# EAGLE design ethernet_jack_cnc_shield_2.5 (EAGLE 9.6.1)
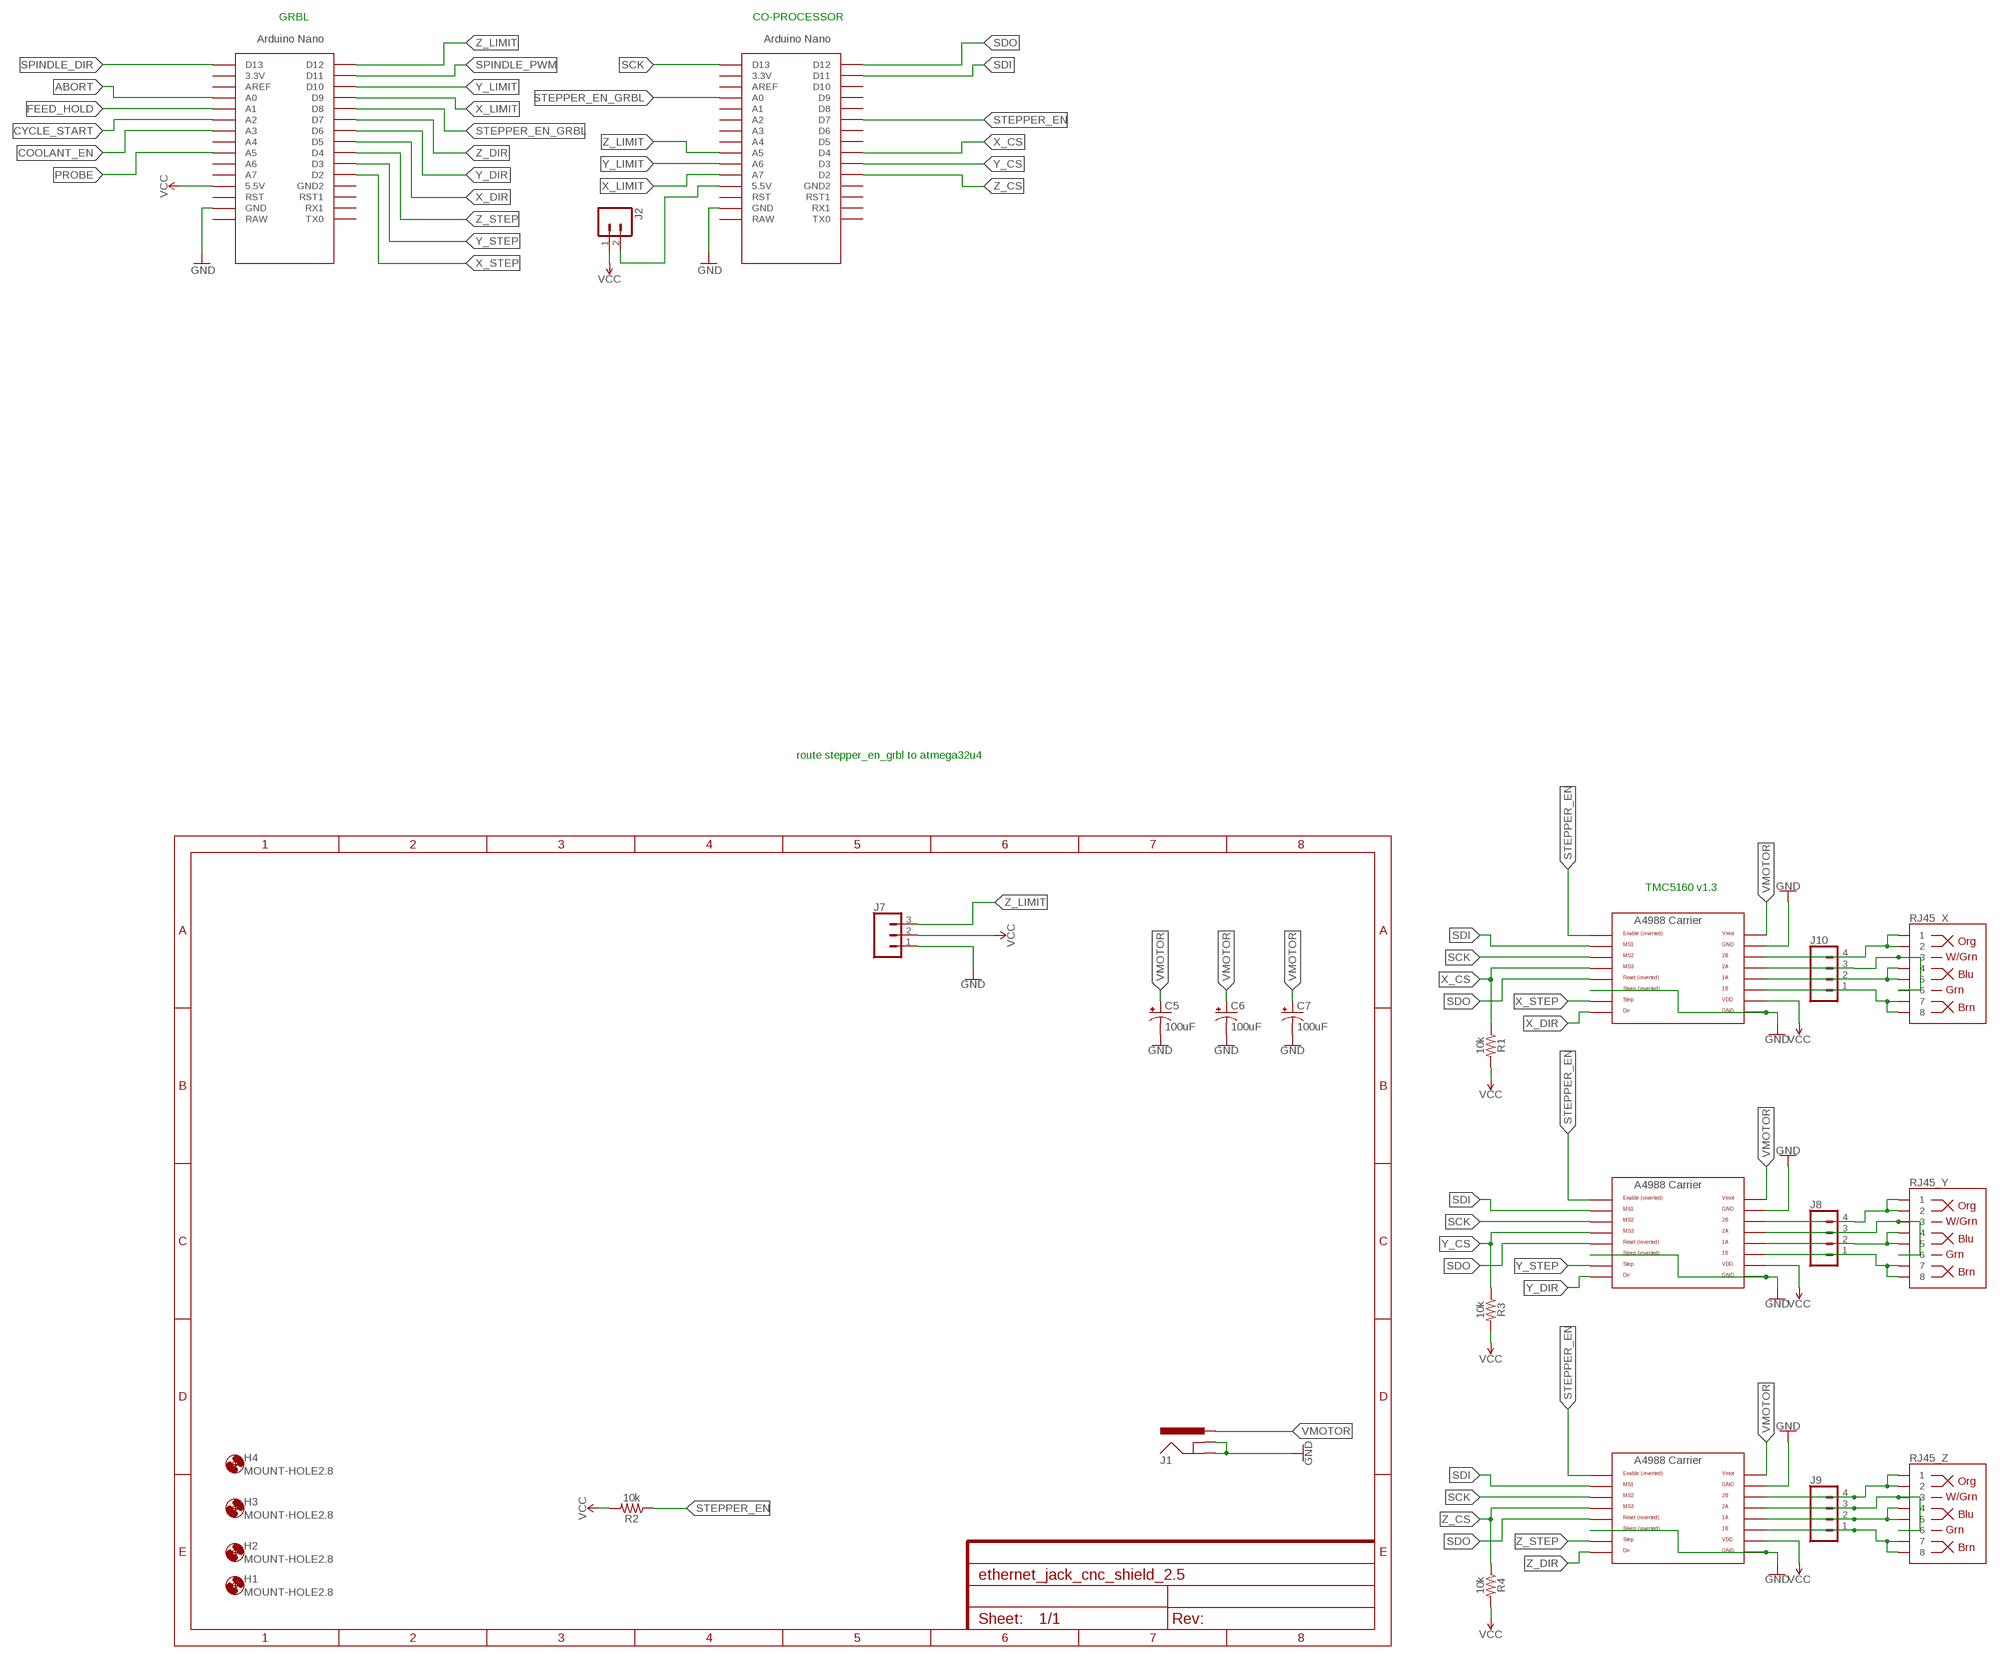
[diagram p0: schematic, sheet 1]

## Parts
C5  100uF  100UF-POLAR-25V-20%(ELEC)  [PANASONIC_D]
C6  100uF  100UF-POLAR-25V-20%(ELEC)  [PANASONIC_D]
C7  100uF  100UF-POLAR-25V-20%(ELEC)  [PANASONIC_D]
H1  MOUNT-HOLE2.8  [2,8]
H2  MOUNT-HOLE2.8  [2,8]
H3  MOUNT-HOLE2.8  [2,8]
H4  MOUNT-HOLE2.8  [2,8]
J1  POWER_JACKPTH_BREAD  [POWER_JACK_PTH_BREAD]
J2  M02PTH  [1X02]
J7  CONN_03  [1X03]
J8  CONN_04  [1X04]
J9  CONN_04  [1X04]
J10  CONN_04  [1X04]
R1  10k  RESISTOR1206  [1206]
R2  10k  RESISTOR1206  [1206]
R3  10k  RESISTOR1206  [1206]
R4  10k  RESISTOR1206  [1206]
RJ45_X  RJ45  RJ45-8  [RJ45-8]
RJ45_Y  RJ45  RJ45-8  [RJ45-8]
RJ45_Z  RJ45  RJ45-8  [RJ45-8]
U$2  A4988BREAKOUT  [A4988BREAKOUT]
U$3  A4988BREAKOUT  [A4988BREAKOUT]
U$4  A4988BREAKOUT  [A4988BREAKOUT]
U$5  NANO  [NANO]
U$7  NANO  [NANO]

## Nets
ABORT: U$5.A0
COOLANT_EN: U$5.A3
CYCLE_START: U$5.A2
FEED_HOLD: U$5.A1
GND: C5.- C6.- C7.- J1.GND J1.GNDBREAK J7.1 U$2.GND U$2.GND@0(GND) U$2.SLP(SLEEP) U$3.GND U$3.GND@0(GND) U$3.SLP(SLEEP) U$4.GND U$4.GND@0(GND) U$4.SLP(SLEEP) U$5.GND U$7.GND
N$1 [power]: J10.4 RJ45_X.1 RJ45_X.2 U$4.2B
N$2: J2.2 U$7.5V(5.5V)
N$4 [power]: J10.3 RJ45_X.3 RJ45_X.6 U$4.2A
N$6 [power]: J10.2 RJ45_X.4 RJ45_X.5 U$4.1A
N$8 [power]: J10.1 RJ45_X.7 RJ45_X.8 U$4.1B
N$20 [power]: J8.4 RJ45_Y.1 RJ45_Y.2 U$2.2B
N$21 [power]: J8.3 RJ45_Y.3 RJ45_Y.6 U$2.2A
N$22 [power]: J8.2 RJ45_Y.4 RJ45_Y.5 U$2.1A
N$23 [power]: J8.1 RJ45_Y.7 RJ45_Y.8 U$2.1B
N$28 [power]: J9.4 RJ45_Z.1 RJ45_Z.2 U$3.2B
N$29 [power]: J9.3 RJ45_Z.3 RJ45_Z.6 U$3.2A
N$30 [power]: J9.2 RJ45_Z.4 RJ45_Z.5 U$3.1A
N$31 [power]: J9.1 RJ45_Z.7 RJ45_Z.8 U$3.1B
PROBE: U$5.A5
SCK: U$2.MS2 U$3.MS2 U$4.MS2 U$7.D13
SDI: U$2.MS1 U$3.MS1 U$4.MS1 U$7.D11
SDO: U$2.RST U$3.RST U$4.RST U$7.D12
SPINDLE_DIR: U$5.D13
SPINDLE_PWM: U$5.D11
STEPPER_EN: R2.1 U$2.EN U$3.EN U$4.EN U$7.D7
STEPPER_EN_GRBL: U$5.D8 U$7.A0
VCC: J2.1 J7.2 R1.2 R2.2 R3.2 R4.2 U$2.VDD U$3.VDD U$4.VDD U$5.5V(5.5V)
VMOTOR [power]: C5.+ C6.+ C7.+ J1.PWR U$2.VMOT U$3.VMOT U$4.VMOT
X_CS: R1.1 U$4.MS3 U$7.D4
X_DIR: U$4.DIR U$5.D5
X_LIMIT: U$5.D9 U$7.A7
X_STEP: U$4.STEP U$5.D2
Y_CS: R3.1 U$2.MS3 U$7.D3
Y_DIR: U$2.DIR U$5.D6
Y_LIMIT: U$5.D10 U$7.A6
Y_STEP: U$2.STEP U$5.D3
Z_CS: R4.1 U$3.MS3 U$7.D2
Z_DIR: U$3.DIR U$5.D7
Z_LIMIT: J7.3 U$5.D12 U$7.A5
Z_STEP: U$3.STEP U$5.D4
Unconnected: U$5.3.3V U$5.A4 U$5.A6 U$5.A7 U$5.AREF U$5.GND1(GND2) U$5.ICSP1 U$5.ICSP2 U$5.ICSP3 U$5.ICSP4 U$5.ICSP5 U$5.ICSP6 U$5.RAW U$5.RST U$5.RST1 U$5.RX1 U$5.TX0 U$7.3.3V U$7.A1 U$7.A2 U$7.A3 U$7.A4 U$7.AREF U$7.D5 U$7.D6 U$7.D8 U$7.D9 U$7.D10 U$7.GND1(GND2) U$7.ICSP1 U$7.ICSP2 U$7.ICSP3 U$7.ICSP4 U$7.ICSP5 U$7.ICSP6 U$7.RAW U$7.RST U$7.RST1 U$7.RX1 U$7.TX0

## Notes on the sheet
- GRBL | CO-PROCESSOR
- route stepper_en_grbl to atmega32u4
- TMC5160 v1.3

## Library data of the parts
C5-C7 = SparkFun-Capacitors:100UF-POLAR: 100µF polarized capacitors A capacitor is a passive two-terminal electrical component used to store electrical energy temporarily in an electric field.; PROD_ID: CAP-12547
H1-H4 = holes:MOUNT-HOLE: MOUNTING HOLE with drill center marker
J1 = SparkFun-Connectors:POWER_JACK: Power Jack Connector This is the standard 5.5mm barrel jack for power. The PTH is the most common, proven, reliable, footprint. The Slot footprint only works if the mill layer is transmitted to the PCB fab house so be warned. Here are the connectors we sell at SparkFun: DC Barrel Power Jack/Connector <https://www.sparkfun.com/products/119> (PRT-00119) DC Barrel Power Jack/Connector (SMD) <https://www.sparkfun.com/products/12748> (PRT-12748) DC Barrel Jack Adapter - Breadboard Compatible <https://www.sparkfun.com/products/10811> (PRT-10811) It is used on this SparkFun product (and many, many others): SparkFun RedBoard - Programmed with Arduino <https://www.sparkfun.com/products/12757> (DEV-12757) Also, if you need a mating power supply or connector, please check these out: Wall Adapter Power Supply - 9VDC 650mA <https://www.sparkfun.com/products/298> (TOL-00298) DC Barrel Jack Adapter - Male <https://www.sparkfun.com/products/10287> (PRT-10287); PROD_ID: PRT-10811
J2 = SparkFun-Connectors:M02: Standard 2-pin 0.1" header. Use with - straight break away headers ( PRT-00116) - right angle break away headers (PRT-00553) - swiss pins (PRT-00743) - machine pins (PRT-00117) - female headers (PRT-00115) Molex polarized connector foot print use with: PRT-08233 with associated crimp pins and housings. 2.54_SCREWTERM for use with PRT-10571. 3.5mm Screw Terminal footprints for PRT-08084 5mm Screw Terminal footprints for use with PRT-08432
J7 = SparkFun-Connectors:CONN_03: Multi connection point. Often used as Generic Header-pin footprint for 0.1 inch spaced/style header connections On any of the 0.1 inch spaced packages, you can populate with these: Break Away Headers - Straight <https://www.sparkfun.com/products/116> (PRT-00116) Break Away Male Headers - Right Angle <https://www.sparkfun.com/products/553> (PRT-00553) Female Headers <https://www.sparkfun.com/products/115> (PRT-00115) Break Away Headers - Machine Pin <https://www.sparkfun.com/products/117> (PRT-00117) Break Away Female Headers - Swiss Machine Pin <https://www.sparkfun.com/products/743> (PRT-00743) Stackable Header - 3 Pin (Female, 0.1") <https://www.sparkfun.com/products/13875> (PRT-13875) For SCREWTERMINALS and SPRING TERMINALS visit here: Screw Terimnals on SparkFun.com <https://www.sparkfun.com/search/results?term=Screw+Terminals> (5mm/3.5mm/2.54mm spacing) This device is also useful as a general connection point to wire up your design to another part of your project. Our various solder wires solder well into these plated through hole pads. Hook-Up Wire - Assortment (Stranded, 22 AWG) <https://www.sparkfun.com/products/11375> (PRT-11375) Hook-Up Wire - Assortment (Solid Core, 22 AWG) <https://www.sparkfun.com/products/11367> (PRT-11367) View the entire wire category on our website here <https://www.sparkfun.com/categories/141> Special notes: Molex polarized connector foot print use with SKU : PRT-08232 with associated crimp pins and housings.
J8-J10 = SparkFun-Connectors:CONN_04: Multi connection point. Often used as Generic Header-pin footprint for 0.1 inch spaced/style header connections On any of the 0.1 inch spaced packages, you can populate with these: Break Away Headers - Straight <https://www.sparkfun.com/products/116> (PRT-00116) Break Away Male Headers - Right Angle <https://www.sparkfun.com/products/553> (PRT-00553) Female Headers <https://www.sparkfun.com/products/115> (PRT-00115) Break Away Headers - Machine Pin <https://www.sparkfun.com/products/117> (PRT-00117) Break Away Female Headers - Swiss Machine Pin <https://www.sparkfun.com/products/743> (PRT-00743) For SCREWTERMINALS and SPRING TERMINALS visit here: Screw Terimnals on SparkFun.com <https://www.sparkfun.com/search/results?term=Screw+Terminals> (5mm/3.5mm/2.54mm spacing) This device is also useful as a general connection point to wire up your design to another part of your project. Our various solder wires solder well into these plated through hole pads. Hook-Up Wire - Assortment (Stranded, 22 AWG) <https://www.sparkfun.com/products/11375> (PRT-11375) Hook-Up Wire - Assortment (Solid Core, 22 AWG) <https://www.sparkfun.com/products/11367> (PRT-11367) View the entire wire category on our website here <https://www.sparkfun.com/categories/141> Special notes: Molex polarized connector foot print use with SKU : PRT-08231 with associated crimp pins and housings. 1MM SMD Version SKU: PRT-10208; PROD_ID: CONN-09696
R1-R4 = SparkFun-Resistors:RESISTOR: Generic Resistor Package
RJ45_X RJ45_Y RJ45_Z = SparkFun-Connectors:RJ45-8: RJ45 Jack - 8 pin Simple RJ45, 8-pin connection. Commonly used for Cat5, Cat5e, and Cat6 Ethernet cables. Here is the connector we sell at SparkFun: RJ45 8-Pin Connector <https://www.sparkfun.com/products/643> (PRT-00643) Datasheet <https://cdn.sparkfun.com/datasheets/Prototyping/04908.pdf> It is used on this SparkFun product: SparkFun RJ45 Breakout <https://www.sparkfun.com/products/716> (BOB-00716) Note, you may also be interested in the "MAGJACK" version of this. It is basically a RJ45 connector, but also has some status LEDs built into the connector housing. You can check that out in this library at the device named "MAGJACK.dev" and see these products online: RJ45 Ethernet MagJack-Compatible <https://www.sparkfun.com/products/8534> (PRT-08534) SparkFun RJ45 MagJack Breakout <https://www.sparkfun.com/products/13021> (BOB-13021); PROD_ID: CONN-08506; SF_ID: PRT-00643
U$2-U$4 = RepRapjr:A4988BREAKOUT
U$5 U$7 = Arduino-clone:NANO: Arduino Nano

## Net classes
1 power: width 0.508 mm, clearance 0.254 mm

## Board
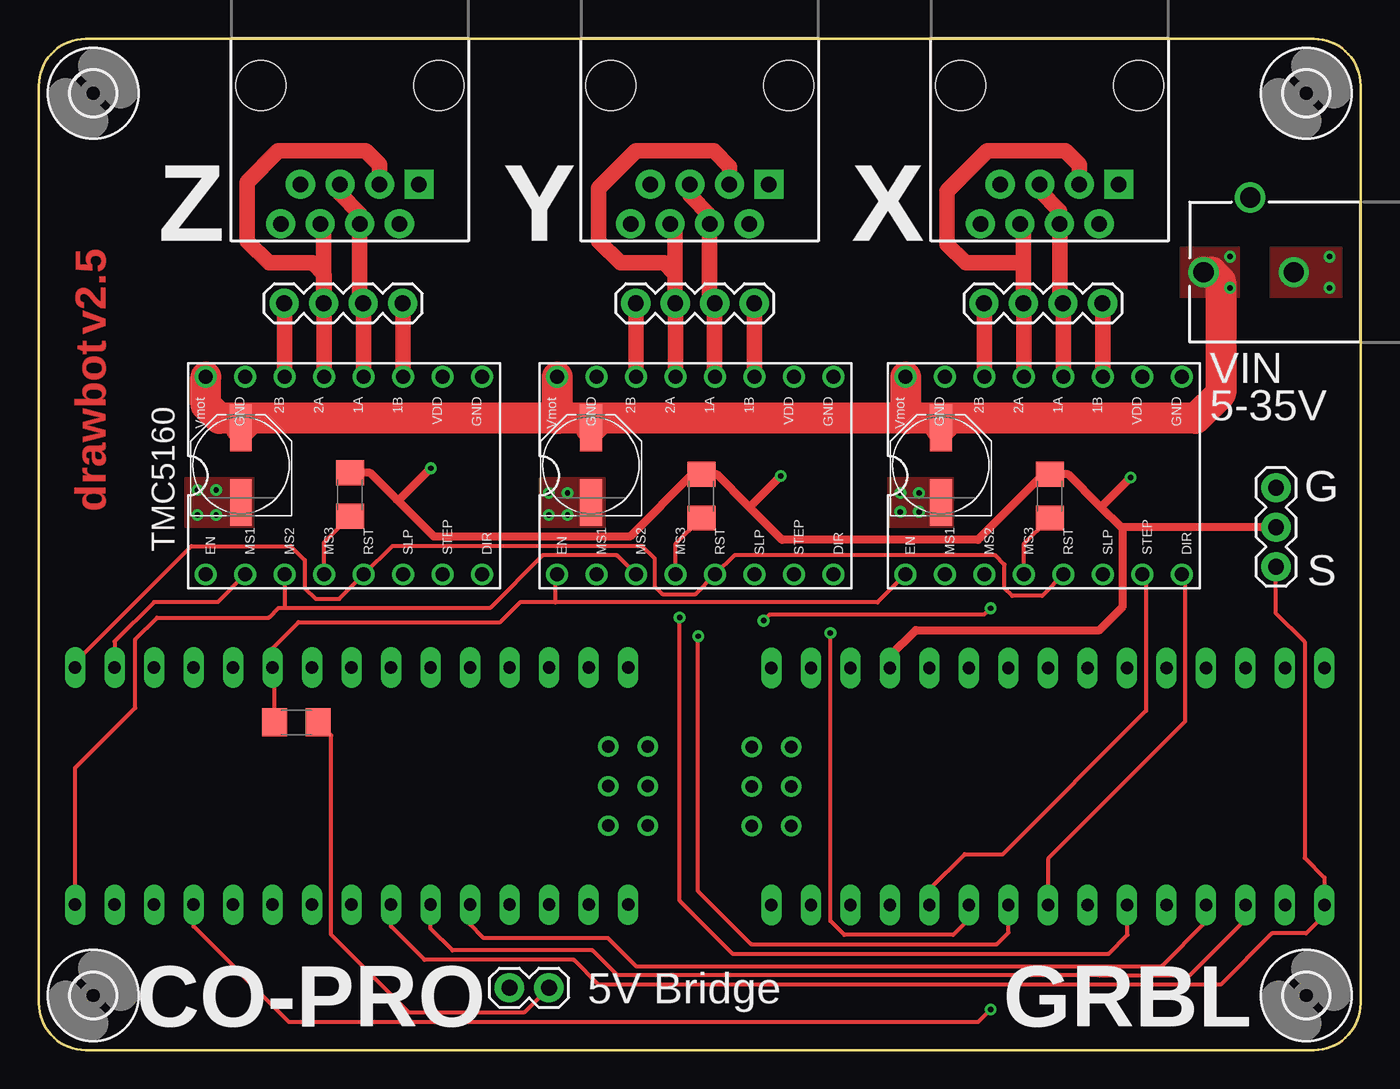
[diagram p1: board, top side]
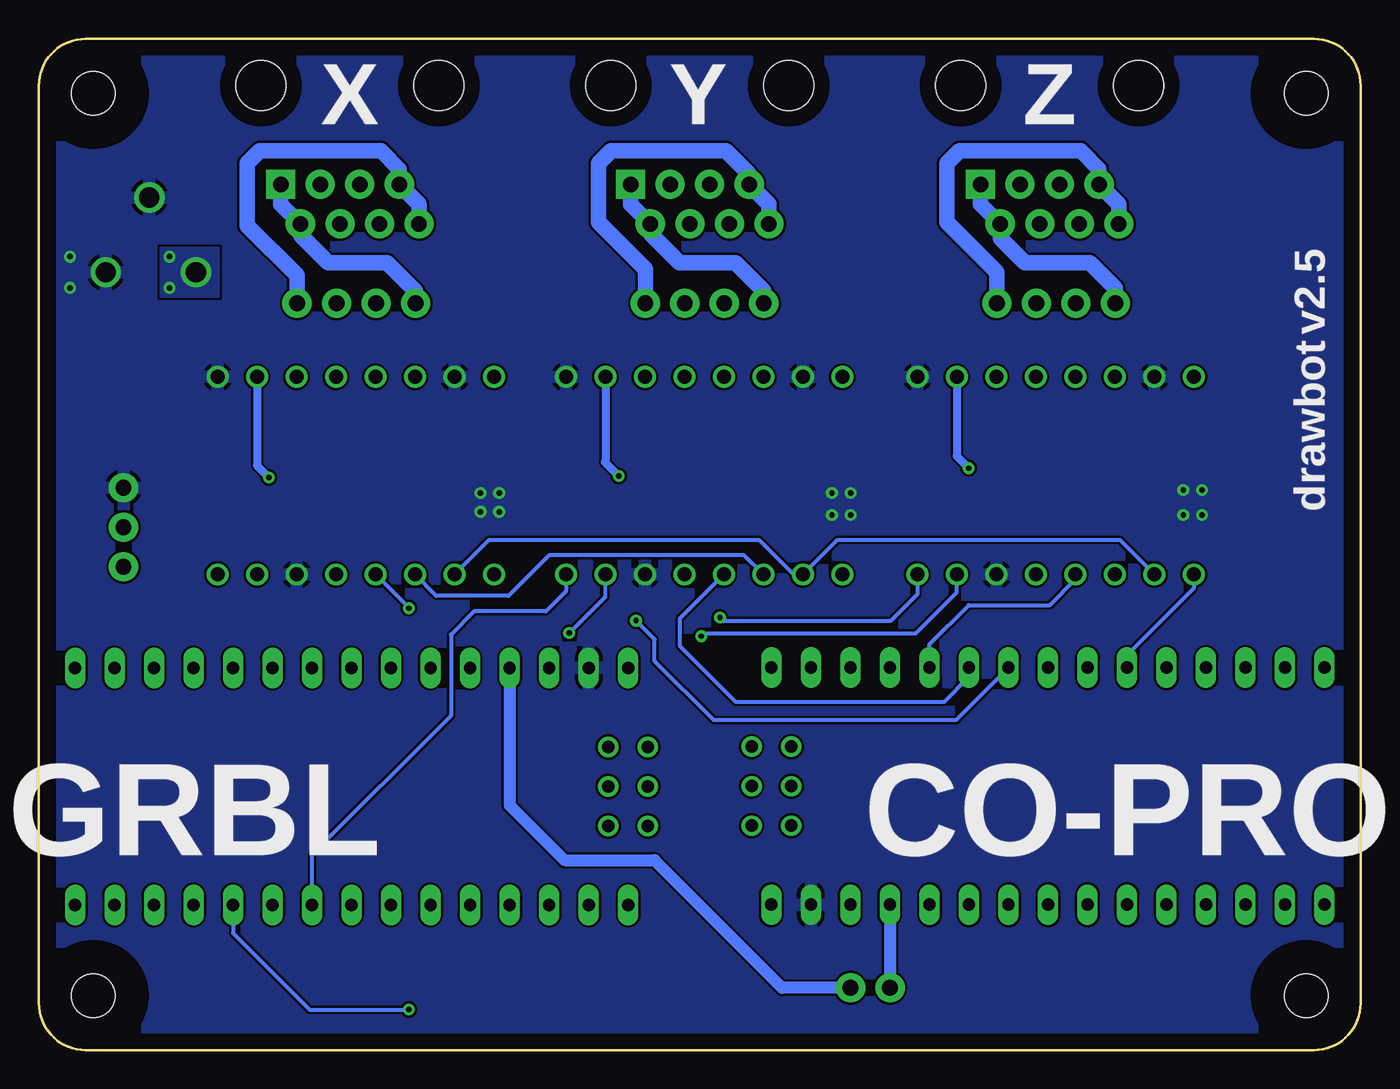
[diagram p2: board, bottom side, seen from below]

Size 85 x 65 mm. Coordinates in mm from the lower left corner, seen from the top.
Outline: 85,62 85,3 arc-90 82,0 3,0 arc-90 0,3 0,62 arc-90 3,65 82,65 arc-90 85,62
Copper layers (1*16): Top 0.035mm / dielectric 1.5mm / Bottom 0.035mm
Design rules "default": minimum track width 6mil, minimum drill 0.35mm, track to track 6mil, track to pad 6mil, pad to pad 6mil, via to via 6mil, smd to smd 6mil, copper to edge 40mil, drill to drill 6mil, minimum pad ring 10mil, minimum via ring 8mil, stop-mask expansion 4mil, vias tented up to drill 0mil, thermal gap 10mil

### Footprints (pad centres in the part's own frame; a part is rotated, then mirrored left to right if it is on the bottom)
PANASONIC_D = smd 3 x 1.4: + 2.4,0; - -2.4,0
2,8 = hole 2.8: 0,0
POWER_JACK_PTH_BREAD = drill 1.3: GND 0,7.9; GNDBREAK 4.8,10.7; PWR 0,13.7
1X02 = drill 1.016 pad 1.88: 1 0,0; 2 2.54,0
1X03 = drill 1.016 pad 1.88: 1 0,0; 2 2.54,0; 3 5.08,0
1X04 = drill 1.016 pad 1.88: 1 0,0; 2 2.54,0; 3 5.08,0; 4 7.62,0
1206 = smd 1.6 x 1.8: 1 -1.4,0; 2 1.4,0
RJ45-8 = drill 1 pad 1.88 square: 1 -4.445,6.35 | drill 1 pad 1.88: 2 -3.175,8.89; 3 -1.905,6.35; 4 -0.635,8.89; 5 0.635,6.35; 6 1.905,8.89; 7 3.175,6.35; 8 4.445,8.89 | hole 3.2: -5.715,0; 5.715,0
A4988BREAKOUT = drill 0.9: 1A 8.89,1.27; 1B 11.43,1.27; 2A 6.35,1.27; 2B 3.81,1.27; DIR 16.51,-11.43; EN -1.27,-11.43; GND 16.51,1.27; GND@0 1.27,1.27; MS1 1.27,-11.43; MS2 3.81,-11.43; MS3 6.35,-11.43; RST 8.89,-11.43; SLP 11.43,-11.43; STEP 13.97,-11.43; VDD 13.97,1.27; VMOT -1.27,1.27
NANO = drill 0.8 long: 3.3V -10.16,24.13; 5V -10.16,-1.27; A0 -10.16,19.05; A1 -10.16,16.51; A2 -10.16,13.97; A3 -10.16,11.43; A4 -10.16,8.89; A5 -10.16,6.35; A6 -10.16,3.81; A7 -10.16,1.27; AREF -10.16,21.59; D2 5.08,1.27; D3 5.08,3.81; D4 5.08,6.35; D5 5.08,8.89; D6 5.08,11.43; D7 5.08,13.97; D8 5.08,16.51; D9 5.08,19.05; D10 5.08,21.59; D11 5.08,24.13; D12 5.08,26.67; D13 -10.16,26.67; GND -10.16,-6.35; GND1 5.08,-1.27; RAW -10.16,-8.89; RST -10.16,-3.81; RST1 5.08,-3.81; RX1 5.08,-6.35; TX0 5.08,-8.89 | drill 0.8: ICSP1 -5.08,-10.16; ICSP2 -5.08,-7.62; ICSP3 -2.54,-10.16; ICSP4 -2.54,-7.62; ICSP5 0,-10.16; ICSP6 0,-7.62

### Placement (x,y rotation side)
C5  35.5,37.6 90 top
C6  13,37.6 90 top
C7  58,37.6 90 top
H1  3.5,3.5 0 top
H2  3.5,61.5 0 top
H3  81.5,3.5 0 top
H4  81.5,61.5 0 top
J1  88.6,50 90 top
J2  32.8,4 180 top
J7  79.56,36.15 270 top
J8  46,48 180 top
J9  23.39,48 180 top
J10  68.4,48 180 top
R1  65,35.6 90 top
R2  16.56,21.06 0 top
R3  42.6,35.6 90 top
R4  20,35.7 90 top
RJ45_X  65,62 180 top
RJ45_Y  42.5,62 180 top
RJ45_Z  20,62 180 top
U$2  34.6,42 0 top
U$3  12,42 0 top
U$4  57,42 0 top
U$5  56,14.4 270 top
U$7  29,19.5 90 top

### Tracks (layer width: path | path; a pad name or v marks a point on that pad's centre or on a via)
GND  (via drill 0.35)
  other vias: 10.2,36 10.2,34.4 11.4,34.4 11.4,36 34,34.4 32.8,34.4 32.8,35.8 34,35.8 55.4,35.8 56.6,35.8 56.6,34.6 55.4,34.6 83,51 83,49
  pour Bottom (rank 2): 0,0 85,0 85,65 0,65
  pour Top (no thermals): 13.8,36.8 9.4,36.8 9.4,33.6 13.8,33.6
  pour Top (no thermals): 36.4,33.6 32.2,33.6 32.2,36.8 36.4,36.8
  pour Top (no thermals): 58.8,33.6 54.6,33.6 54.6,36.8 58.8,36.8
  pour Top (no thermals): 79.2,51.6 79.2,48.4 83.8,48.4 83.8,51.6
N$1
  Top 1: U$4.2B 60.81,47.97 J10.4
  Bottom 1: RJ45_X.1 69.44,54.38 RJ45_X.2 68.17,52.38 66.4,50.6 62.6,50.6 60.78,48.78 J10.4
N$2
  Bottom 0.762: U$7.5V J2.2
N$4
  Top 1: U$4.2A 63.35,47.97 J10.3 63.32,50.6 | 63.32,50.6 63.32,52.88 RJ45_X.6 | RJ45_X.3 66.91,56.9 66,57.8 61,57.8 58.4,55.2 58.4,51.8 59.6,50.6 63.32,50.6
N$6
  Top 1: U$4.1A 65.89,47.97 J10.2 65.66,48.2 65.66,53.09 RJ45_X.4 65.64,53.97 64.36,55.23 RJ45_X.5
N$8
  Top 1: U$4.1B 68.43,47.97 J10.1
  Bottom 1: RJ45_X.8 60.55,54.38 RJ45_X.7 61.83,56.62 63,57.8 70.8,57.8 71.6,57 71.6,53 68.4,49.8 J10.1
N$20
  Top 1: J8.4 38.41,47.97 U$2.2B
  Bottom 1: RJ45_Y.1 46.95,54.38 RJ45_Y.2 45.67,52.48 43.8,50.6 40.2,50.6 38.38,48.78 J8.4
N$21
  Top 1: U$2.2A 40.95,47.97 J8.3 | J8.3 40.92,49.88 40.2,50.6 37.4,50.6 36,52 36,55.4 38.4,57.8 43.4,57.8 44.41,56.8 RJ45_Y.3 | RJ45_Y.6 40.92,52.78 J8.3
N$22
  Top 1: U$2.1A 43.46,43.3 J8.2 43.13,48.33 RJ45_Y.4 43.13,53.66 41.87,54.94 RJ45_Y.5
N$23
  Top 1: U$2.1B 46.03,47.97 J8.1
  Bottom 1: RJ45_Y.8 38.05,54.38 RJ45_Y.7 39.33,56.33 40.8,57.8 48.2,57.8 49,57 49,53.2 46,50.2 J8.1
N$28
  Top 1: U$3.2B 15.81,47.96 J9.4
  Bottom 1: J9.4 15.77,48.97 17.4,50.6 21.6,50.6 23.18,52.17 RJ45_Z.2 24.45,54.38 RJ45_Z.1
N$29
  Top 1: U$3.2A 18.35,47.96 | 18.35,47.96 J9.3 18.31,52.9 RJ45_Z.6 | RJ45_Z.3 21.91,56.9 21,57.8 15.4,57.8 13.4,55.8 13.4,52 14.8,50.6 17.6,50.6 18.35,49.85 18.35,47.96
N$30
  Top 1: U$3.1A 20.89,47.96 J9.2 20.64,48.22 RJ45_Z.4 20.64,53.77 19.36,55.03 RJ45_Z.5
N$31
  Top 1: U$3.1B 23.43,47.96 J9.1
  Bottom 1: RJ45_Z.8 15.55,54.38 RJ45_Z.7 16.82,56.62 18,57.8 25.8,57.8 26.6,57 26.6,53.2 23.39,49.99 J9.1
SCK
  Top 0.254: U$7.D13 2.33,18.13 6.2,22 6.2,26.4 7.6,27.8 14.8,27.8 15.4,28.4 15.8,28.4 | U$2.MS2 37.18,31.8 32.4,31.8 29,28.4 15.8,28.4 | U$3.MS2 15.81,28.41 15.8,28.4
  Bottom 0.254: U$2.MS2 39.64,31.8 52.2,31.8 54.8,29.2 59.44,29.2 U$4.MS2
SDI
  Top 0.254: U$3.MS1 11.5,28.8 7.4,28.8 4.87,26.27 U$7.D11
  Bottom 0.254: U$4.MS1 56.04,32.8 38.7,32.8 36.47,30.57 U$2.MS1 33.64,32.8 15.5,32.8 U$3.MS1
SDO
  Top 0.254: U$7.D12 2.33,24.93 9.8,32.4 16.2,32.4 17.1,31.5 17.1,29.7 17.8,29 19.32,29 U$3.RST 22.72,32.4 38.8,32.4 39.6,31.6 39.6,29.8 40.1,29.3 42.22,29.3 U$2.RST 44.72,31.8 61.5,31.8 62.1,31.2 62.1,29.7 62.6,29.2 64.52,29.2 U$4.RST
STEPPER_EN
  Top 0.254: U$4.EN 53.93,28.77 33.2,28.77 | 33.2,28.77 30.93,28.77 29.66,27.5 16.7,27.5 15,25.8 15,24.61 U$7.D7 15.16,24.45 R2.1 | U$2.EN 33.2,30.44 33.2,28.77
  Bottom 0.254: U$3.EN 10.73,29.67 15.03,25.37 U$7.D7
STEPPER_EN_GRBL  (via drill 0.35)
  Top 0.254: U$7.A0 9.95,7.94 16.09,1.8 60.4,1.8 v61.2,2.6
  Bottom 0.254: U$5.D8 72.51,7.52 67.59,2.6 v61.2,2.6
VCC  (via drill 0.35)
  Top 0.254: J2.1 31.2,2.4 23.8,2.4 18.8,7.4 18.8,20.22 R2.2
  Top 0.508: 45.6,35 47.8,32.8 60.4,32.8 64.6,37 R1.2 66.2,37 68.2,35 | 45.6,35 43.6,37 R3.2 42,37 38,33 25.4,33 23,35.4 | R4.2 21.3,37.1 23,35.4 | v47.7,36.9 45.8,35 45.6,35 | 69.7,33.5 69.7,28.5 68.2,27 56.4,27 54.73,25.33 U$5.5V | 69.7,33.5 68.2,35 | v70.2,36.8 68.4,35 68.2,35 | v25.2,37.4 23.2,35.4 23,35.4 | J7.2 69.81,33.61 69.7,33.5
  Bottom 0.508: U$4.VDD 70.97,37.57 v70.2,36.8 | U$2.VDD 48.57,37.83 48.6,37.8 v47.7,36.9 | U$3.VDD 25.97,38.17 v25.2,37.4
  Bottom 0.762: U$5.5V 54.73,15.73 51.2,12.2 45.4,12.2 37.2,4 J2.1
VMOTOR  (via drill 0.35)
  Top 2: J1.PWR 75.4,50 76,49.4 76,42.2 74.4,40.6 58.6,40.6 | U$3.VMOT 10.73,41.47 11.6,40.6 13.6,40.6 | 58.6,40.6 55.8,40.6 | 55.8,40.6 36.1,40.6 | 36.1,40.6 33.4,40.6 | 33.4,40.6 13.6,40.6 | U$2.VMOT 33.33,40.67 33.4,40.6 | U$4.VMOT 55.73,40.67 55.8,40.6 | C6.+ 13.6,40.6 | C5.+ 36.1,40.6 | C7.+ 58.6,40.6
  other vias: 76.6,49 76.6,51
  pour Top (no thermals): 77.2,51.6 73.4,51.6 73.4,48.4 77.2,48.4
  pour Bottom (no thermals): 73.4,48.4 77.2,48.4 77.2,51.6 73.4,51.6
X_CS  (via drill 0.35)
  Top 0.254: v46.6,27.6 47,28 60.8,28 v61.2,28.4 | U$4.MS3 63.35,32.55 R1.1
  Bottom 0.254: U$7.D4 26.03,21.2 41.6,21.2 45.4,25 45.4,26.4 v46.6,27.6 | v61.2,28.4 61.2,28.42 U$4.MS3
X_DIR
  Top 0.254: U$4.DIR 73.71,30.37 73.71,21.11 64.89,12.29 U$5.D5
X_LIMIT
  Top 0.254: U$7.A7 27.73,8.07 28.6,7.2 36.6,7.2 38.4,5.4 72.2,5.4 75.05,8.25 U$5.D9
X_STEP
  Top 0.254: U$4.STEP 71.2,30.34 71.2,21.8 62,12.6 59.55,12.6 57.27,10.32 U$5.D2
Y_CS
  Top 0.254: U$2.MS3 40.95,32.55 R3.1
  Bottom 0.254: U$2.MS3 43.8,27.72 43.8,26 40.2,22.4 26.77,22.4 25.19,23.98 U$7.D3
Y_DIR
  Bottom 0.254: U$2.DIR 51.11,29.49 52.4,28.2 57,28.2 58.5,26.7 58.5,21.5 67.43,12.57 U$5.D6
Y_LIMIT
  Top 0.254: U$7.A6 25.19,7.81 26.6,6.4 35.6,6.4 37.2,4.8 68.2,4.8 68.39,4.8 74,4.8 77.6,8.4 U$5.D10
Y_STEP  (via drill 0.35)
  Top 0.254: U$5.D3 59.81,8.41 58.8,7.4 51.8,7.4 50.9,8.3 v50.9,26.8
  Bottom 0.254: U$2.STEP 48.57,29.13 v50.9,26.8
Z_CS
  Top 0.254: U$3.MS3 18.35,32.65 R4.1
  Bottom 0.254: U$7.D2 27.73,26.07 25.2,28.6 20,28.6 18.35,30.25 U$3.MS3
Z_DIR  (via drill 0.35)
  Top 0.254: v41.2,27.8 41.2,9.6 44.6,6.2 68.8,6.2 70,7.4 70,9.29 U$5.D7
  Bottom 0.254: U$3.DIR 28.51,29.29 30.2,27.6 41,27.6 v41.2,27.8
Z_LIMIT
  Top 0.254: U$7.A5 22.65,7.95 24.8,5.8 34.4,5.8 36,4.2 76,4.2 79.3,7.5 81.5,7.5 82.67,8.67 U$5.D12 82.67,11.08 81.4,12.35 81.4,26.23 79.56,28.07 J7.3
Z_STEP  (via drill 0.35)
  Top 0.254: v42.4,26.6 42.4,10.2 45.8,6.8 61.6,6.8 62.35,7.55 U$5.D4
  Bottom 0.254: v42.4,26.6 42.2,26.8 28.6,26.8 25.97,29.43 U$3.STEP

### Text on the board
Top: v2.5 | drawbot
tPlace: Z | Y | X | VIN | 5-35V | TMC5160 | G | S | CO-PRO | 5V Bridge | GRBL
bPlace: Z | Y | X | v2.5 | drawbot | CO-PRO | GRBL
tKeepout: v2.5 | drawbot